# EasyEDA schematic SCH_Flight-Computer-V5_2024-08-05.json

## Sheets
1 Components: TITLE: Components; REV: 1.0; Date: 2024-08-05; Sheet: 1/1; Drawn By: usedgenes; Company: Company
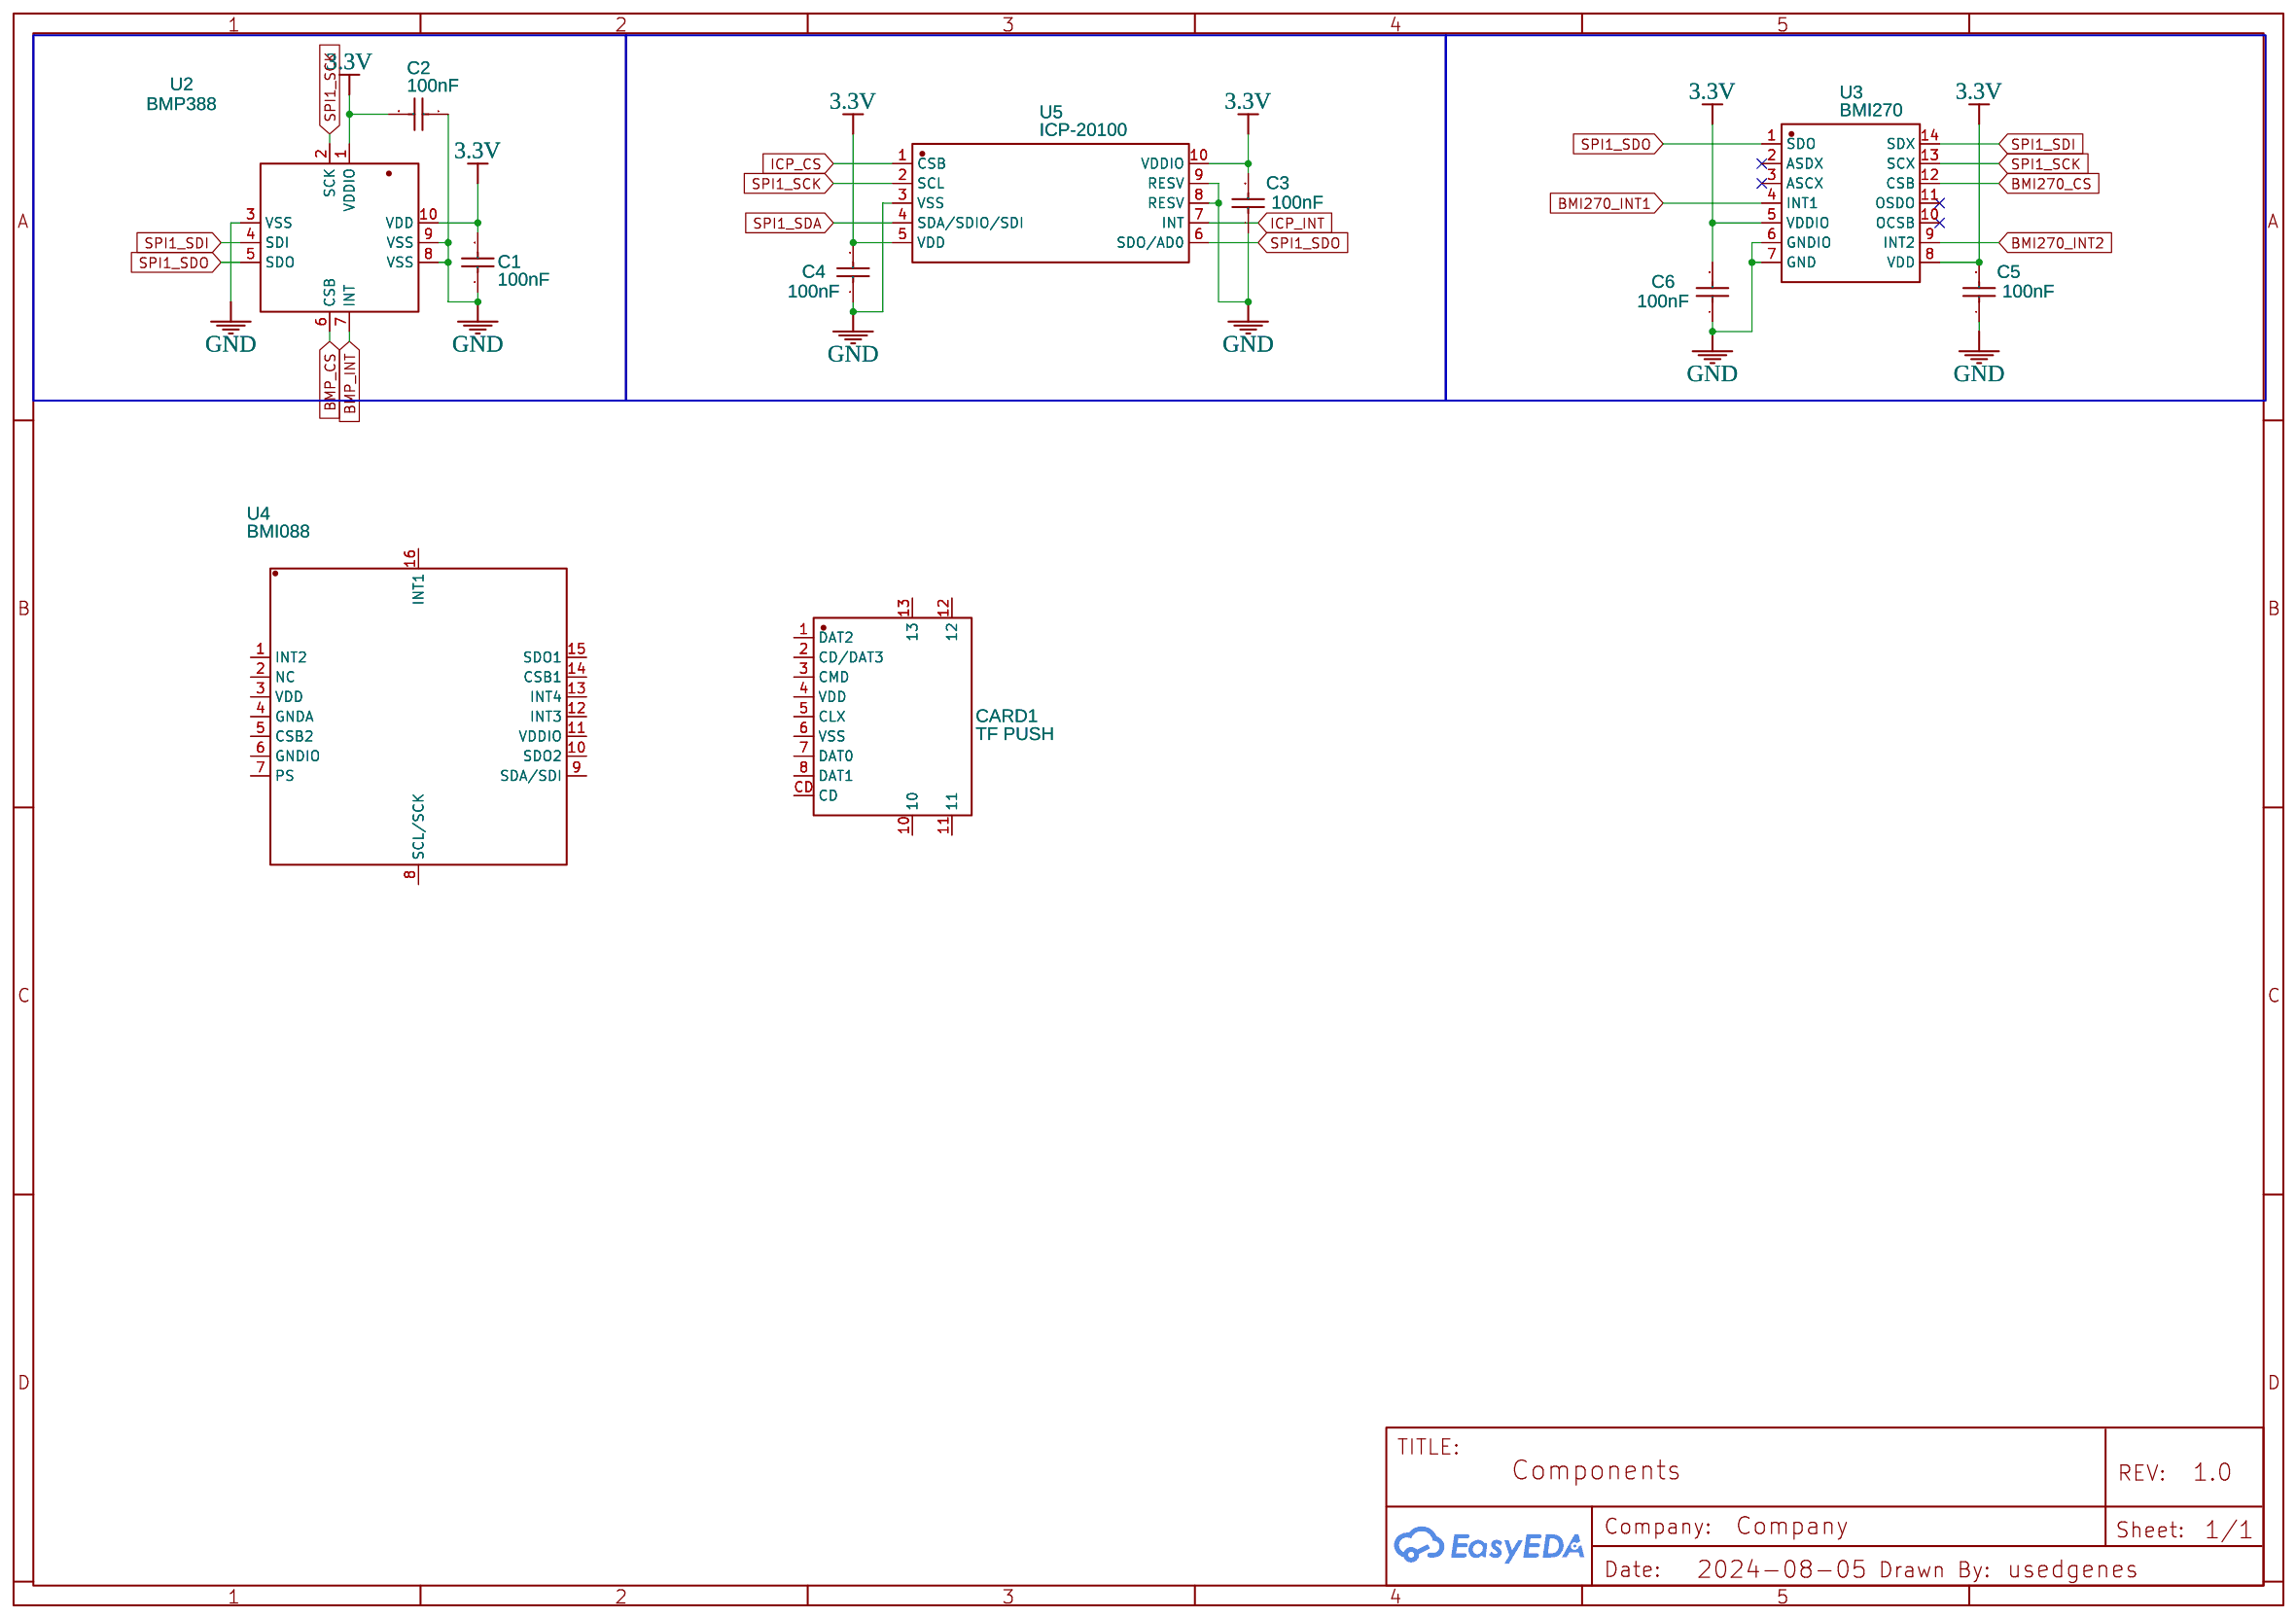
[diagram p0: Components]
2 STM: TITLE: STM Components; Company: Your Company
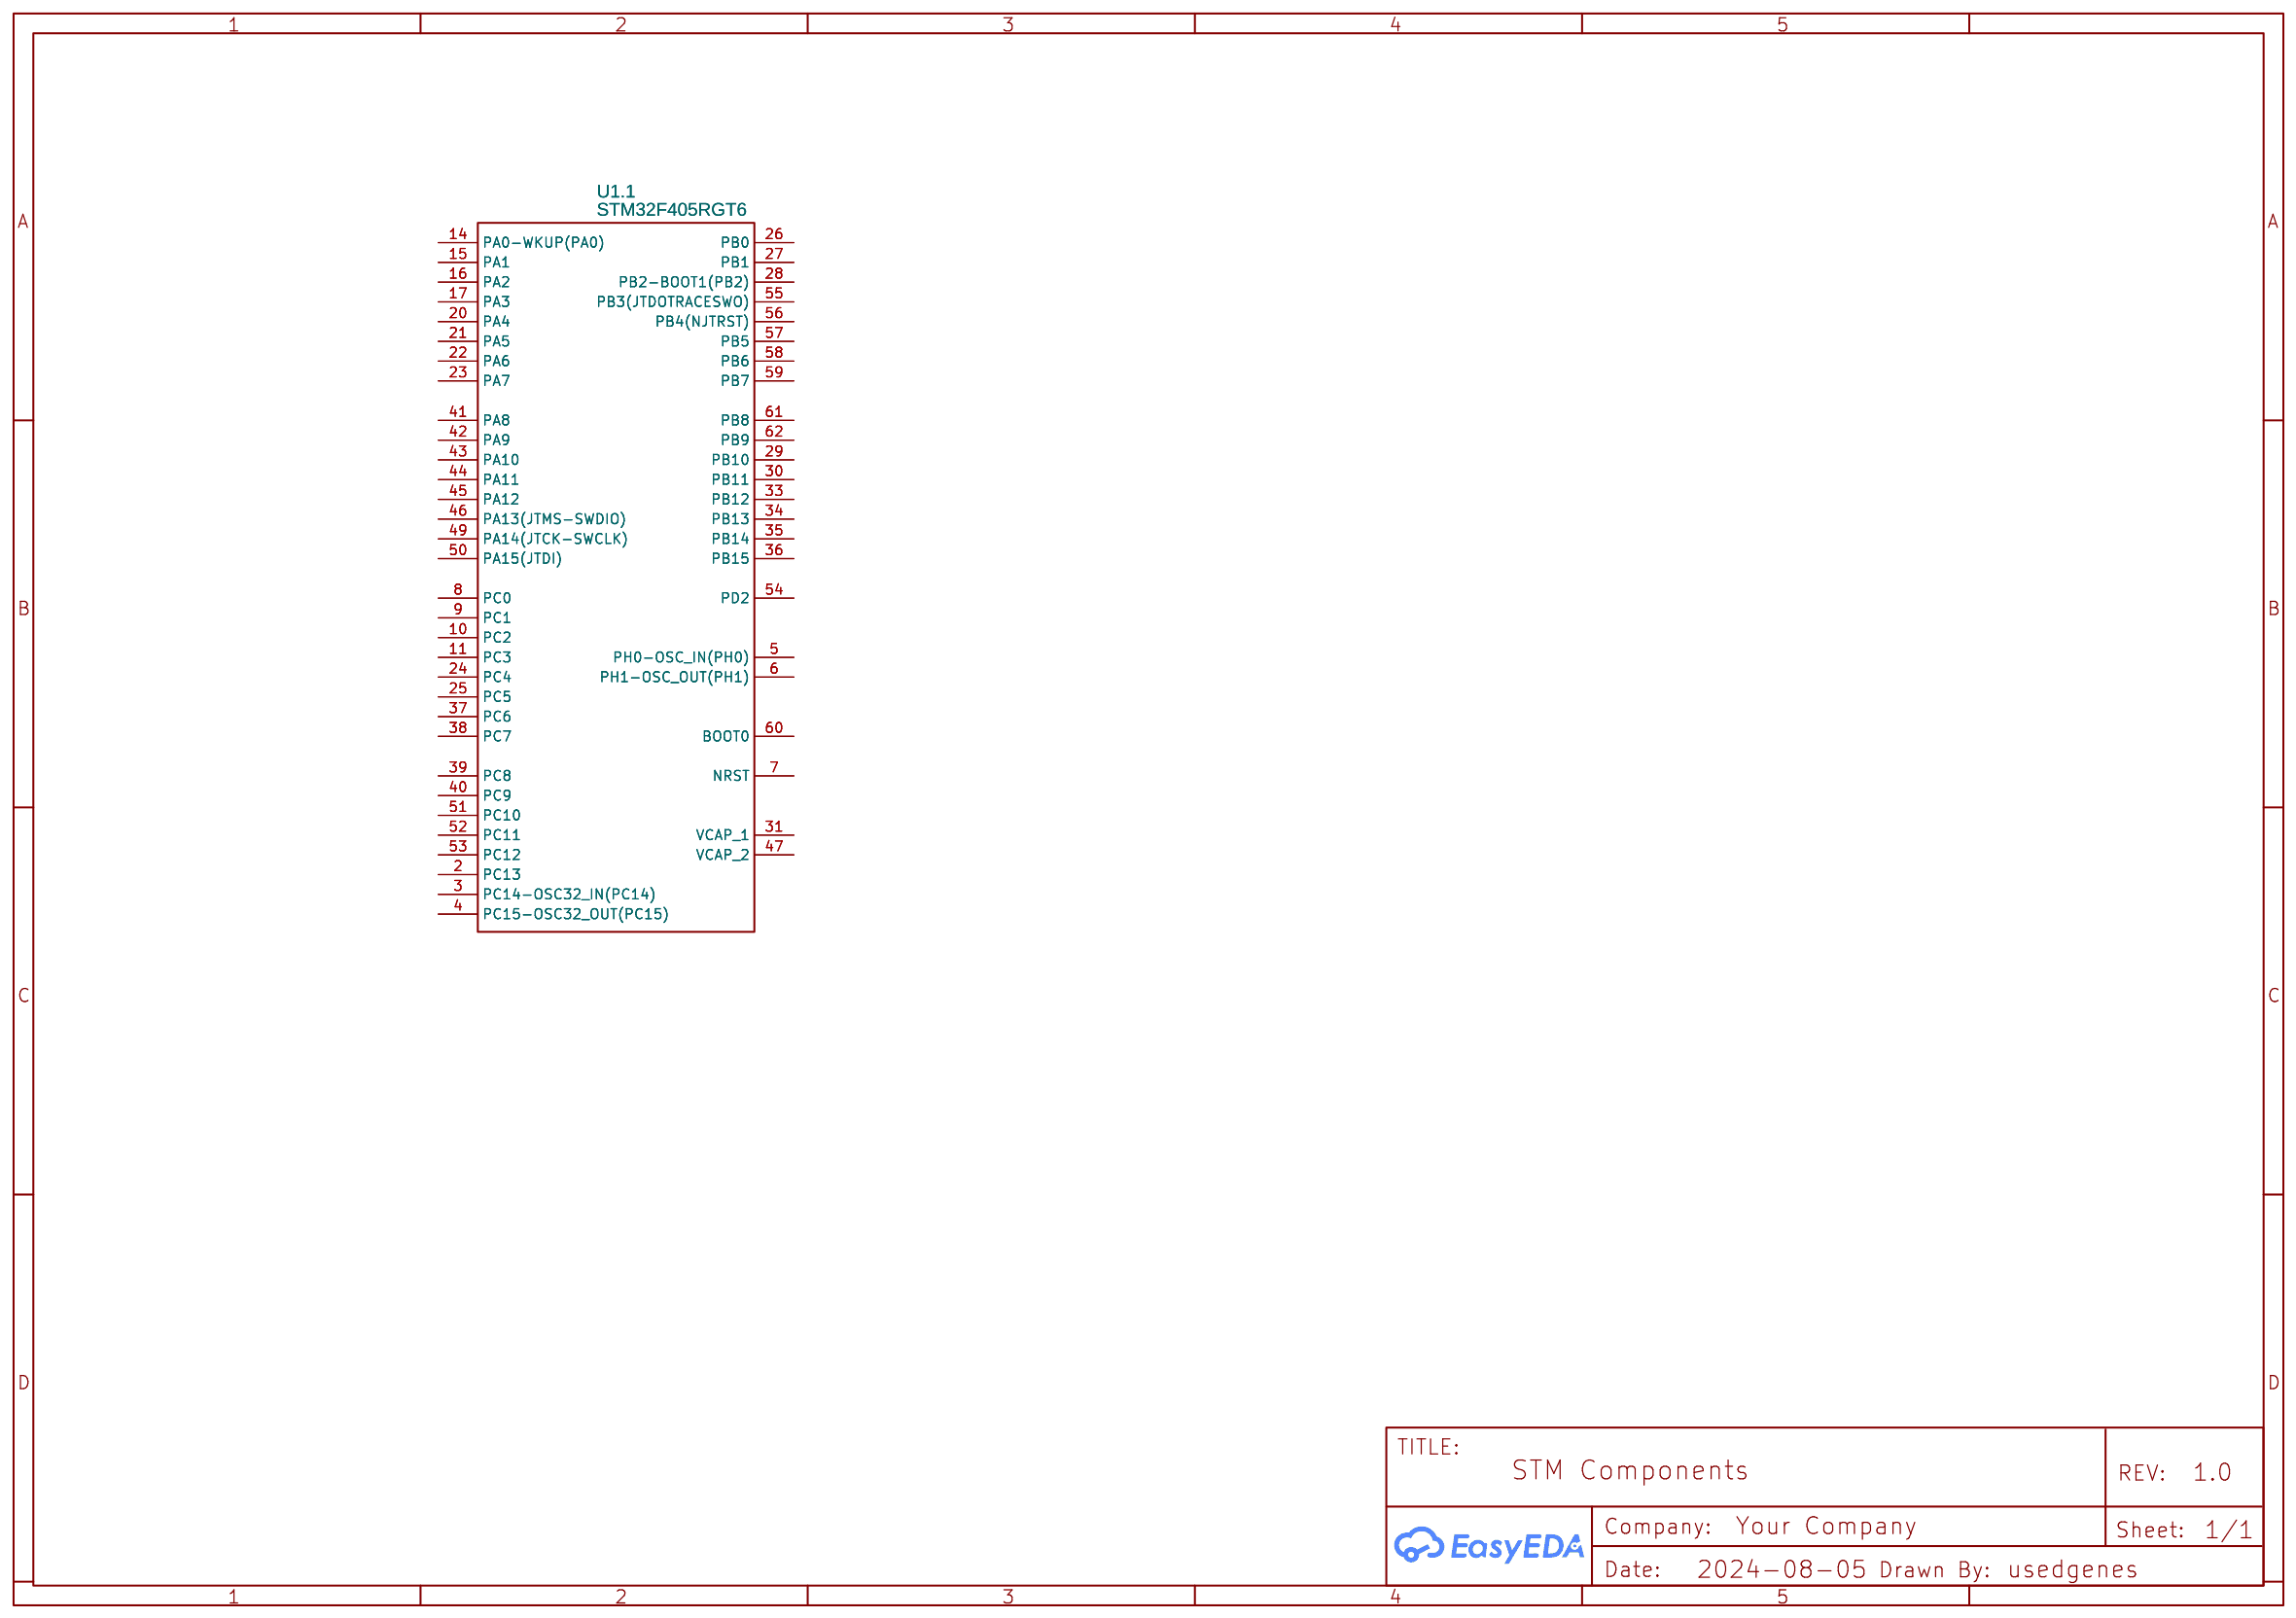
[diagram p1: STM]

## Parts
sheet Components
C1  100nF  [C0402]
C2  100nF  [C0402]
C3  100nF  [C0402]
C4  100nF  [C0402]
C5  100nF  [C0402]
C6  100nF  [C0402]
CARD1  TF PUSH  [TF-SMD_TF-PUSH]
U2  BMP388  [SENSORM-SMD_BMP388]
U3  BMI270  [LGA-14_L3.0-W2.5-P0.50-BR]
U4  BMI088  [LGA-16_L4.5-W3.0-P0.50-BL]
U5  ICP-20100  [LGA-10_L2.0-W2.0-P0.50-TL_ICP-20100]
sheet STM
U1  STM32F405RGT6  [LQFP-64_L10.0-W10.0-P0.50-LS12.0-BL]  (section 1)

## Library data of the parts
C1-C6 = CL05B104KO5NNNC: Supplier: LCSC; Manufacturer: SAMSUNG(三星); Supplier Part: C1525; JLCPCB Part Class: Basic Part
CARD1 = TF PUSH: Contributor: LCSC; Supplier: LCSC; Supplier Part: C393941; Manufacturer: SHOU HAN(首韩); JLCPCB Part Class: Extended Part
U2 = BMP388: Contributor: LCSC; Supplier: LCSC; Supplier Part: C779278; Manufacturer: Bosch(博世); JLCPCB Part Class: Extended Part
U3 = BMI270: Contributor: LCSC; Supplier: LCSC; Supplier Part: C2836813; Manufacturer: Bosch(博世); JLCPCB Part Class: Extended Part
U4 = BMI088: Contributor: LCSC; Supplier: LCSC; Supplier Part: C194919; Manufacturer: Bosch(博世); JLCPCB Part Class: Extended Part
U5 = ICP-20100: Supplier: LCSC; Supplier Part: C5343527; Manufacturer: TDK; JLCPCB Part Class: Extended Part; Contributor: lcsc
U1 = STM32F405RGT6: tags: STM32; subpart_no: 1; image: http://image.lceda.cn/szlcsc/C15742.jpg; Supplier Part: C15742; Supplier: LCSC; Manufacturer: ST(意法半导体); JLCPCB Part Class: Extended Part

## Nets
3.3V: C1.2 C2.2 C3.2 C4.2 C5.2 C6.2 U2.1(VDDIO) U2.10(VDD) U3.5(VDDIO) U3.8(VDD) U5.5(VDD) U5.10(VDDIO)
GND: C1.1 C2.1 C3.1 C4.1 C5.1 C6.1 U2.3(VSS) U2.8(VSS) U2.9(VSS) U3.6(GNDIO) U3.7(GND) U5.3(VSS) U5.8(RESV) U5.9(RESV)
BMI270_CS: U3.12(CSB)
BMI270_INT1: U3.4(INT1)
BMI270_INT2: U3.9(INT2)
BMP_CS: U2.6(CSB)
BMP_INT: U2.7(INT)
ICP_CS: U5.1(CSB)
ICP_INT: U5.7(INT)
SPI1_SCK: U2.2(SCK) U3.13(SCX) U5.2(SCL)
SPI1_SDA: U5.4(SDA/SDIO/SDI)
SPI1_SDI: U2.4(SDI) U3.14(SDX)
SPI1_SDO: U2.5(SDO) U3.1(SDO) U5.6(SDO/AD0)

Not connected (* = marked no-connect by the designer): CARD1 1(DAT2) 2(CD/DAT3) 3(CMD) 4(VDD) 5(CLX) 6(VSS) 7(DAT0) 8(DAT1) 10 11 12 13 CD; U1 2(PC13) 3(PC14-OSC32_IN(PC14)) 4(PC15-OSC32_OUT(PC15)) 5(PH0-OSC_IN(PH0)) 6(PH1-OSC_OUT(PH1)) 7(NRST) 8(PC0) 9(PC1) 10(PC2) 11(PC3) 14(PA0-WKUP(PA0)) 15(PA1) 16(PA2) 17(PA3) 20(PA4) 21(PA5) 22(PA6) 23(PA7) 24(PC4) 25(PC5) 26(PB0) 27(PB1) 28(PB2-BOOT1(PB2)) 29(PB10) 30(PB11) 31(VCAP_1) 33(PB12) 34(PB13) 35(PB14) 36(PB15) 37(PC6) 38(PC7) 39(PC8) 40(PC9) 41(PA8) 42(PA9) 43(PA10) 44(PA11) 45(PA12) 46(PA13(JTMS-SWDIO)) 47(VCAP_2) 49(PA14(JTCK-SWCLK)) 50(PA15(JTDI)) 51(PC10) 52(PC11) 53(PC12) 54(PD2) 55(PB3(JTDOTRACESWO)) 56(PB4(NJTRST)) 57(PB5) 58(PB6) 59(PB7) 60(BOOT0) 61(PB8) 62(PB9); U3 2(ASDX)* 3(ASCX)* 10(OCSB)* 11(OSDO)*; U4 1(INT2) 2(NC) 3(VDD) 4(GNDA) 5(CSB2) 6(GNDIO) 7(PS) 8(SCL/SCK) 9(SDA/SDI) 10(SDO2) 11(VDDIO) 12(INT3) 13(INT4) 14(CSB1) 15(SDO1) 16(INT1)
